# EAGLE design high-range-accelerometer (EAGLE 5.11)
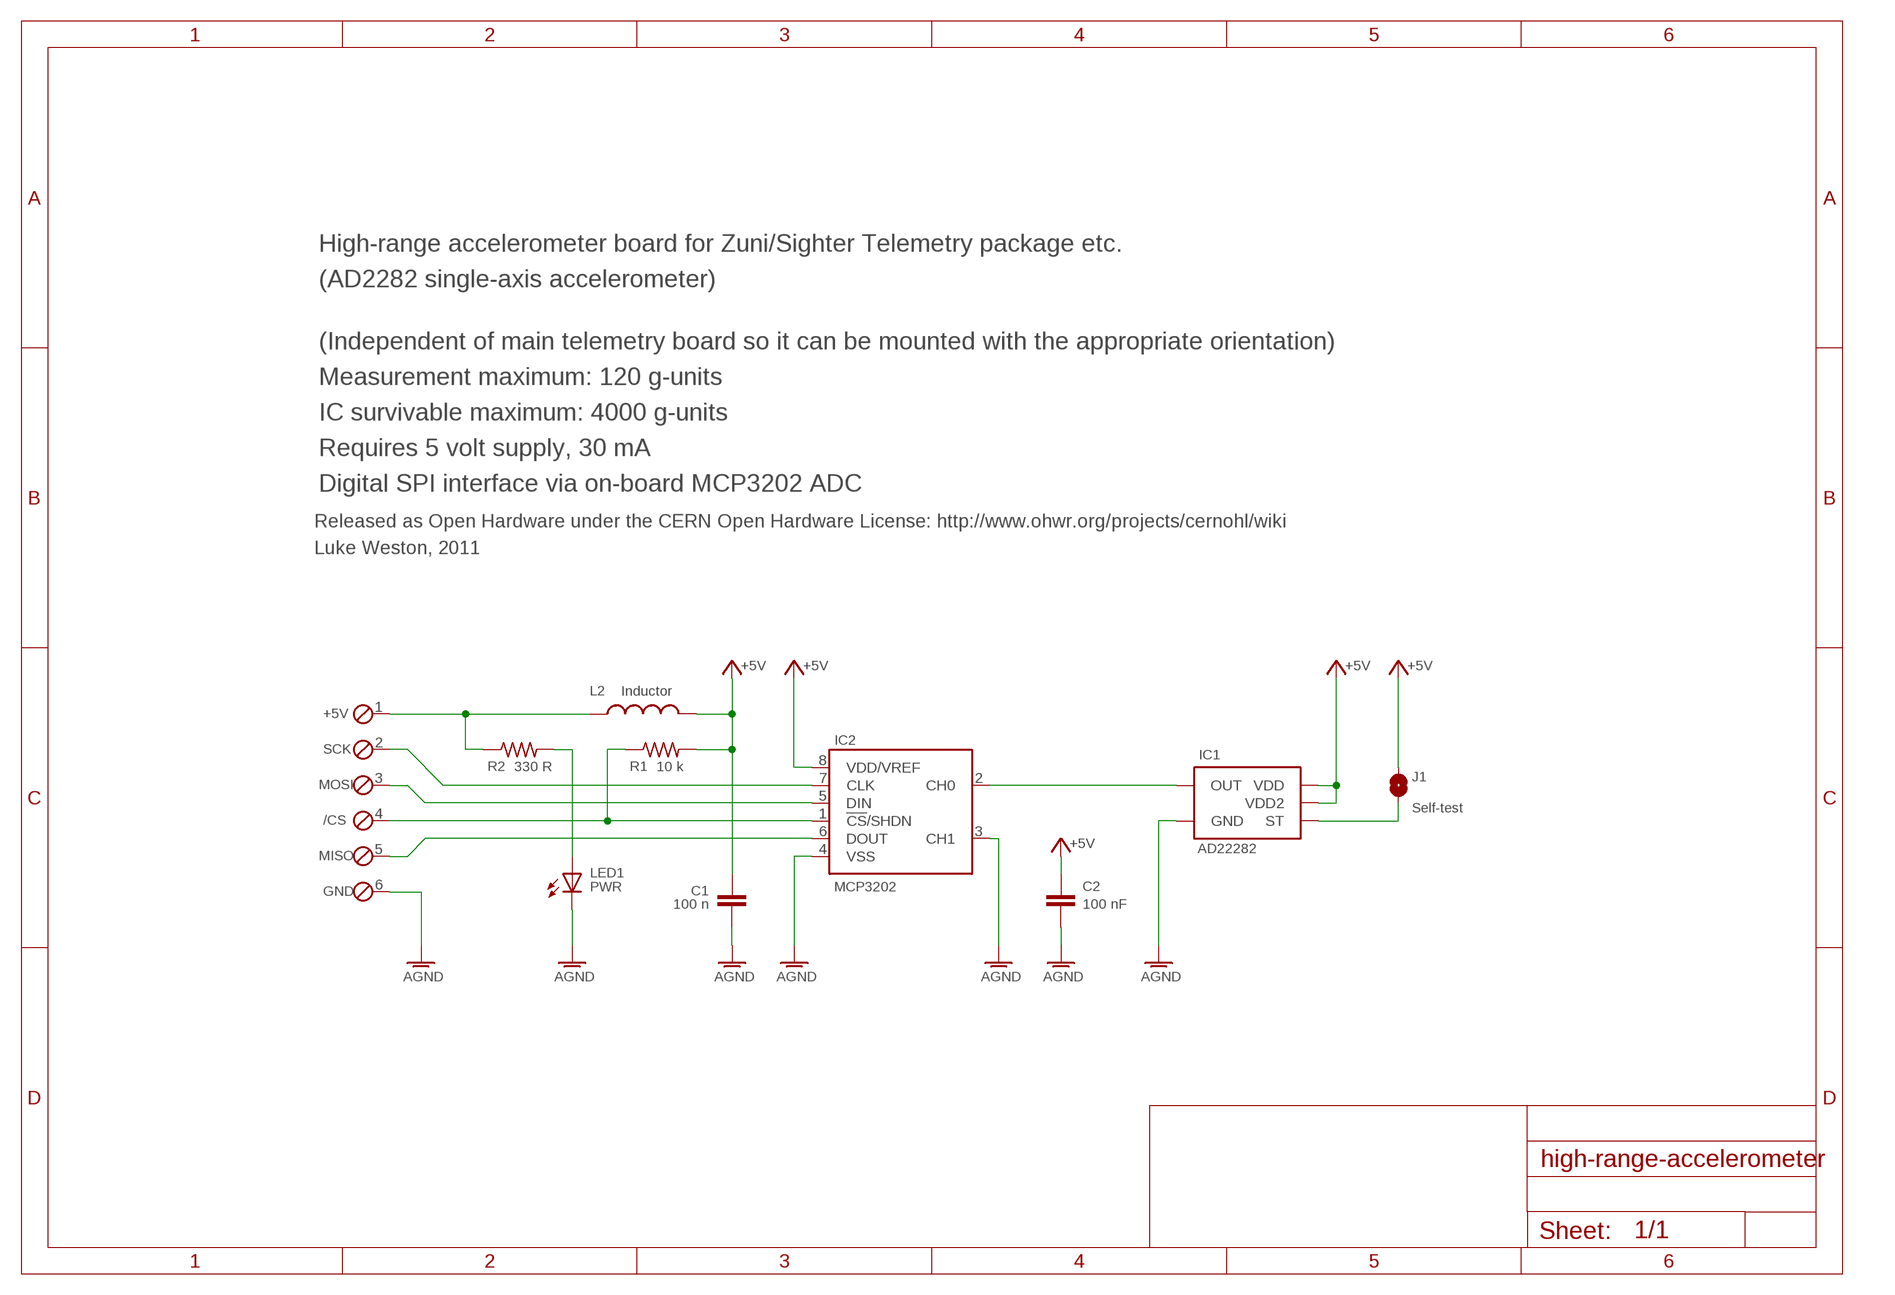
[diagram p0: schematic, sheet 1]

## Parts
C1  100 n  C-EUC0805K  [C0805K]
C2  100 nF  C-EUC0805K  [C0805K]
IC1  AD22282  ADXL193  [ADXL193]
IC2  MCP3202  MCP3202SN  [SO-08]
J1  Self-test  SJ  [SJ]
L2  Inductor  INDUCTOR0805-LARGE  [0805-LARGE]
LED1  PWR  LEDCHIPLED_0805  [CHIPLED_0805]
R1  10 k  R-US_R0805  [R0805]
R2  330 R  R-US_R0805  [R0805]
X1  MPT6  [6POL254]

## Nets
+5V: C1.1 C2.1 IC1.P$7(VDD) IC1.P$8(VDD2) IC2.8(VDD/VREF) J1.2 L2.2 R1.2
AGND: C1.2 C2.2 IC1.P$3(GND) IC2.3(CH1) IC2.4(VSS) LED1.C X1.6
N$1: IC1.P$6(OUT) IC2.2(CH0)
N$2: L2.1 R2.1 X1.1
N$4: IC2.7(CLK) X1.2
N$5: IC2.6(DOUT) X1.5
N$6: IC2.1(!CS!/SHDN) R1.1 X1.4
N$7: IC2.5(DIN) X1.3
N$8: IC1.P$4(ST) J1.1
N$9: LED1.A R2.2

## Notes on the sheet
- High-range accelerometer board for Zuni/Sighter Telemetry package etc.
- (AD2282 single-axis accelerometer)
- (Independent of main telemetry board so it can be mounted with the appropriate orientation)
- Measurement maximum: 120 g-units
- IC survivable maximum: 4000 g-units
- Requires 5 volt supply, 30 mA
- Digital SPI interface via on-board MCP3202 ADC
- Released as Open Hardware under the CERN Open Hardware License: http://www.ohwr.org/projects/cernohl/wiki
- Luke Weston, 2011
- +5V
- SCK
- MOSI
- /CS
- MISO
- GND

## Library data of the parts
C1 C2 = rcl:C-EU: CAPACITOR, European symbol
IC1 = SparkFun:ADXL193: 250g accelerometer analog out
IC2 = microchip-update:MCP3202: 2.7V Dual Channel 12-Bit A/D Converter with SPI Serial Interface Source: http://ww1.microchip.com/downloads/en/DeviceDoc/21034D.pdf
J1 = jumper:SJ: SMD solder JUMPER
L2 = freetronics-master-v1:INDUCTOR: Inductors Basic Inductor/Choke - 0603 and 1206. Footprints are not proven and vary greatly between part numbers.
LED1 = led:LED: LED OSRAM: - CHIPLED LG R971, LG N971, LY N971, LG Q971, LY Q971, LO R971, LY R971 LH N974, LH R974 LS Q976, LO Q976, LY Q976 LO Q996 - Hyper CHIPLED LW Q18S LB Q993, LB Q99A, LB R99A - SideLED LS A670, LO A670, LY A670, LG A670, LP A670 LB A673, LV A673, LT A673, LW A673 LH A674 LY A675 LS A676, LA A676, LO A676, LY A676, LW A676 LS A679, LY A679, LG A679 - Hyper Micro SIDELED® LS Y876, LA Y876, LO Y876, LY Y876 LT Y87S - SmartLED LW L88C, LW L88S LB L89C, LB L89S, LG L890 LS L89K, LO L89K, LY L89K LS L896, LA L896, LO L896, LY L896 - TOPLED LS T670, LO T670, LY T670, LG T670, LP T670 LSG T670, LSP T670, LSY T670, LOP T670, LYG T670 LG T671, LOG T671, LSG T671 LB T673, LV T673, LT T673, LW T673 LH T674 LS T676, LA T676, LO T676, LY T676, LB T676, LH T676, LSB T676, LW T676 LB T67C, LV T67C, LT T67C, LS T67K, LO T67K, LY T67K, LW E67C LS E67B, LA E67B, LO E67B, LY E67B, LB E67C, LV E67C, LT E67C LW T67C LS T679, LY T679, LG T679 LS T770, LO T770, LY T770, LG T770, LP T770 LB T773, LV T773, LT T773, LW T773 LH T774 LS E675, LA E675, LY E675, LS T675 LS T776, LA T776, LO T776, LY T776, LB T776 LHGB T686 LT T68C, LB T68C - Hyper Mini TOPLED® LB M676 - Mini TOPLED Santana® LG M470 LS M47K, LO M47K, LY M47K Source: http://www.osram.convergy.de LUXEON: - LUMILED® LXK2-PW12-R00, LXK2-PW12-S00, LXK2-PW14-U00, LXK2-PW14-V00 LXK2-PM12-R00, LXK2-PM12-S00, LXK2-PM14-U00 LXK2-PE12-Q00, LXK2-PE12-R00, LXK2-PE12-S00, LXK2-PE14-T00, LXK2-PE14-U00 LXK2-PB12-K00, LXK2-PB12-L00, LXK2-PB12-M00, LXK2-PB14-N00, LXK2-PB14-P00, LXK2-PB14-Q00 LXK2-PR12-L00, LXK2-PR12-M00, LXK2-PR14-Q00, LXK2-PR14-R00 LXK2-PD12-Q00, LXK2-PD12-R00, LXK2-PD12-S00 LXK2-PH12-R00, LXK2-PH12-S00 LXK2-PL12-P00, LXK2-PL12-Q00, LXK2-PL12-R00 Source: www.luxeon.com KINGBRIGHT: KA-3528ASYC Source: www.kingbright.com
R1 R2 = rcl:R-US_: RESISTOR, American symbol
X1 = con-phoenix-254:MPT6: PHOENIX CONNECTOR; OC_FARNELL: unknown; OC_NEWARK: unknown

## Board
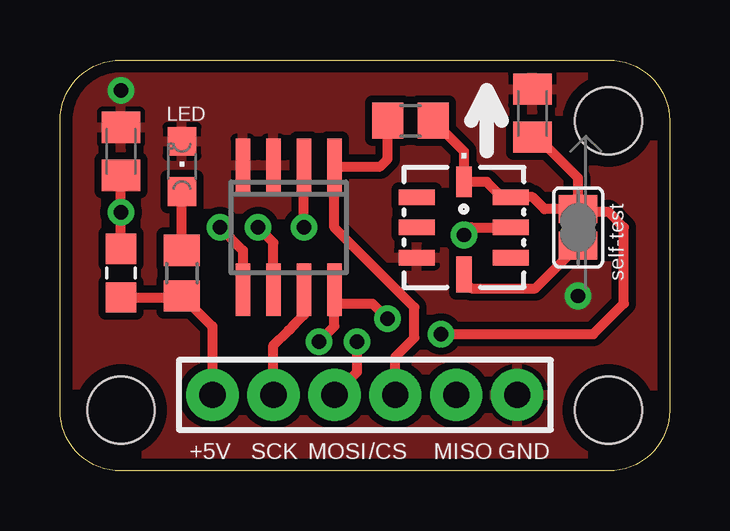
[diagram p1: board, top side]
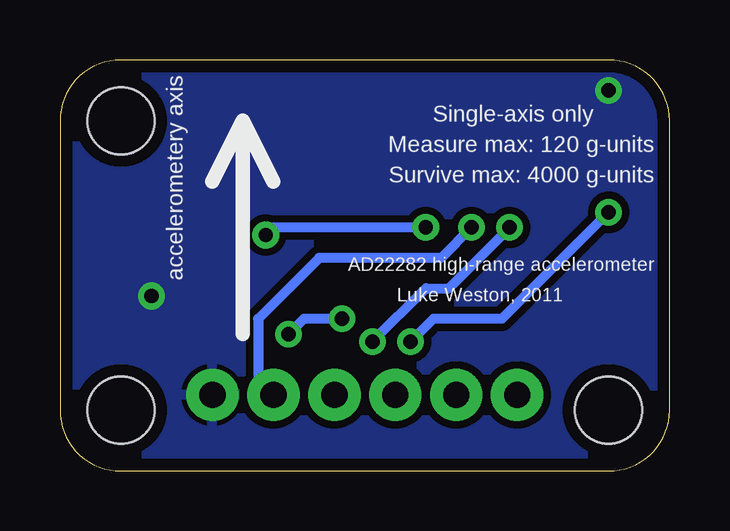
[diagram p2: board, bottom side, seen from below]

Size 25.4 x 17.14 mm. Coordinates in mm from the lower left corner, seen from the top.
Outline: 0,2.54 0,14.61 arc-90 2.54,17.14 22.86,17.14 arc-90 25.4,14.61 25.4,2.54 arc-90 22.86,0 2.54,0 arc-90 0,2.54
Copper layers (1*16): Top 0.035mm / dielectric 1.5mm / Bottom 0.035mm
Design rules "PCBCart-Standard": minimum track width 8mil, minimum drill 0.4mm, track to track 8mil, track to pad 8mil, pad to pad 8mil, via to via 8mil, smd to smd 8mil, copper to edge 20mil, drill to drill 8mil, minimum pad ring 8mil, minimum via ring 10mil, stop-mask expansion 3mil, vias tented up to drill 0mil, thermal gap 8mil
Holes 2.8 mm at 2.54,2.54 22.86,14.61 22.86,2.54

### Footprints (pad centres in the part's own frame; a part is rotated, then mirrored left to right if it is on the bottom)
C0805K = smd 1.3 x 1.6: 1 -1,0; 2 1,0
ADXL193 = smd 1.5 x 0.64: P$1 -1.96,1.26; P$2 -1.96,0; P$3 -1.96,-1.26; P$5 1.96,-1.26; P$6 1.96,0; P$7 1.96,1.26 | smd 0.64 x 1.5: P$4 0,-1.96 | smd 0.64 x 1.27: P$8 0.01,1.9
SO-08 = smd 0.6 x 2.2: 1 -1.905,-2.6; 2 -0.635,-2.6; 3 0.635,-2.6; 4 1.905,-2.6; 5 1.905,2.6; 6 0.635,2.6; 7 -0.635,2.6; 8 -1.905,2.6
SJ = smd 1.168 x 1.6: 1 -0.762,0; 2 0.762,0
0805-LARGE = smd 1.27 x 1.27: 1 -1.016,0; 2 1.016,0
CHIPLED_0805 = smd 1.2 x 1.2: A 0,-1.05; C 0,1.05
R0805 = smd 1.3 x 1.5: 1 -0.95,0; 2 0.95,0
6POL254 = drill 1.1 pad 2.184 round: 1 -6.35,0; 2 -3.81,0; 3 -1.27,0; 4 1.27,0; 5 3.81,0; 6 6.35,0

### Placement (x,y rotation side)
C1  19.68,14.92 90 top
C2  2.54,13.34 90 top
IC1  16.83,10.16 0 top
IC2  9.53,10.16 180 top
J1  21.59,10.16 90 top
L2  2.54,8.26 90 top
LED1  5.08,12.7 0 top
R1  14.61,14.61 0 top
R2  5.08,8.26 90 top
X1  12.7,3.18 0 top

### Tracks (layer width: path | path; a pad name or v marks a point on that pad's centre or on a via)
+5V  (via drill 0.6)
  Top 0.406: J1.2 20.19,10.92 19.7,11.42 IC1.P$7 18.78,11.43 18.41,11.43 17.79,12.06 IC1.P$8 16.84,13.32 R1.2 | v15.88,5.71 22.23,5.71 23.5,6.99 23.5,10.16 22.86,10.79 21.72,10.79 J1.2 | C1.1 19.96,13.92 19.84,13.81 20,13.81 21.59,12.22 J1.2 | L2.2 v2.54,10.79 C2.1 | 11.43,6.99 11.43,6.03 v10.79,5.4 | 11.43,6.99 IC2.8 | 11.43,6.99 13.02,6.99 v13.65,6.35
  Bottom 0.406: v13.65,6.35 15.24,6.35 v15.88,5.71 | v10.79,5.4 9.84,6.35 6.99,6.35 v2.54,10.79
AGND  (via drill 0.6)
  other vias: 21.59,7.3 2.54,15.88
  pour Top (isolate 0.305): -0.64,17.78 26.04,17.78 26.04,-0.64 -0.64,-0.64
  pour Bottom (isolate 0.305): -0.64,17.78 26.04,17.78 26.04,-0.64 -0.64,-0.64
N$1  (via drill 0.6)
  Top 0.406: v16.83,9.84 17.14,10.16 IC1.P$6 | v10.16,10.16 IC2.2
  Bottom 0.406: v10.16,10.16 16.51,10.16 v16.83,9.84
N$2
  Top 0.406: L2.1 5.01,7.24 R2.1 6.35,6.04 X1.1
N$4
  Top 0.406: IC2.7 10.16,6.51 9.76,6.11 9.53,5.87 8.89,5.24 X1.2
N$5  (via drill 0.6)
  Top 0.406: IC2.6 8.89,9.53 v8.26,10.16
  Bottom 0.406: v8.26,10.16 9.53,8.89 14.61,8.89 17.14,6.35 17.14,3.81 X1.5
N$6
  Top 0.406: R1.1 13.66,13.02 13.34,12.7 11.49,12.7 IC2.1 11.43,10.16 14.76,6.83 14.76,5.56 13.97,4.76 | X1.4 13.97,4.76 | 13.97,4.76
N$7  (via drill 0.6)
  Top 0.406: IC2.5 7.62,9.21 v6.67,10.16 | X1.3 12.38,4.13 v12.38,5.4
  Bottom 0.406: v6.67,10.16 9.21,7.62 10.16,7.62 v12.38,5.4
N$8
  Top 0.406: IC1.P$4 16.83,7.94 17.14,7.62 19.81,7.62 J1.1
N$9
  Top 0.406: R2.2 LED1.A

### Text on the board
tPlace: LED | . | self-test | +5V | SCK | MOSI | /CS | MISO | GND
bPlace: accelerometery axis | Single-axis only | Measure max: 120 g-units | Survive max: 4000 g-units | AD22282 high-range accelerometer | Luke Weston, 2011